# Altium schematic sheet shunts_and_amplifiers.SchDoc: Shunts and Amplifiers
size B; Engineer: Jacob Faucett; Organization: CUAir; Address1: L3, 12a Rodborough Rd; Address2: Frenchs Forest; Address3: NSW; Address4: Australia 2086; Revision: 1; SheetNumber: 6; SheetTotal: 9; CompetitionYear: 2025; CPN: N/A; PROJECT: Current Logging and Validation Board
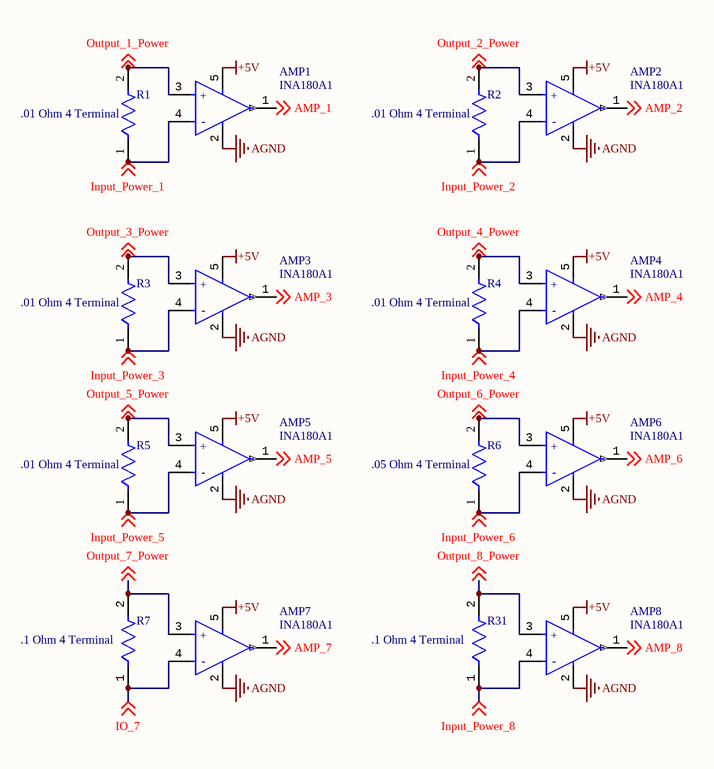
[diagram p0: shunts_and_amplifiers.SchDoc]

## Parts
AMP1  INA180A1  [FP-DBV0005A-IPC_A]
AMP2  INA180A1  [FP-DBV0005A-IPC_A]
AMP3  INA180A1  [FP-DBV0005A-IPC_A]
AMP4  INA180A1  [FP-DBV0005A-IPC_A]
AMP5  INA180A1  [FP-DBV0005A-IPC_A]
AMP6  INA180A1  [FP-DBV0005A-IPC_A]
AMP7  INA180A1  [FP-DBV0005A-IPC_A]
AMP8  INA180A1  [FP-DBV0005A-IPC_A]
R1  .01 Ohm 4 Terminal  [FP-WSR3-MFG]
R2  .01 Ohm 4 Terminal  [FP-WSR3-MFG]
R3  .01 Ohm 4 Terminal  [FP-WSR3-MFG]
R4  .01 Ohm 4 Terminal  [FP-WSR3-MFG]
R5  .01 Ohm 4 Terminal  [FP-WSR3-MFG]
R6  .05 Ohm 4 Terminal  [FP-WSR3-MFG]
R7  .1 Ohm 4 Terminal  [FP-WSR-MFG]
R31  .1 Ohm 4 Terminal  [FP-WSR-MFG]

## Nets
+5V: AMP1.5(VS) AMP2.5(VS) AMP3.5(VS) AMP4.5(VS) AMP5.5(VS) AMP6.5(VS) AMP7.5(VS) AMP8.5(VS)
AGND: AMP1.2(GND) AMP2.2(GND) AMP3.2(GND) AMP4.2(GND) AMP5.2(GND) AMP6.2(GND) AMP7.2(GND) AMP8.2(GND)
AMP_1: AMP1.1(OUT) ; off-sheet AMP_1
AMP_2: AMP2.1(OUT) ; off-sheet AMP_2
AMP_3: AMP3.1(OUT) ; off-sheet AMP_3
AMP_4: AMP4.1(OUT) ; off-sheet AMP_4
AMP_5: AMP5.1(OUT) ; off-sheet AMP_5
AMP_6: AMP6.1(OUT) ; off-sheet AMP_6
AMP_7: AMP7.1(OUT) ; off-sheet AMP_7
AMP_8: AMP8.1(OUT) ; off-sheet AMP_8
Input_Power_1: AMP1.4(IN-) R1.1 ; off-sheet Input_Power_1
Input_Power_2: AMP2.4(IN-) R2.1 ; off-sheet Input_Power_2
Input_Power_3: AMP3.4(IN-) R3.1 ; off-sheet Input_Power_3
Input_Power_4: AMP4.4(IN-) R4.1 ; off-sheet Input_Power_4
Input_Power_5: AMP5.4(IN-) R5.1 ; off-sheet Input_Power_5
Input_Power_6: AMP6.4(IN-) R6.1 ; off-sheet Input_Power_6
Input_Power_8: AMP8.4(IN-) R31.1 ; off-sheet Input_Power_8
IO_7: AMP7.4(IN-) R7.1 ; off-sheet IO_7
Output_1_Power: AMP1.3(IN+) R1.2 ; off-sheet Output_1_Power
Output_2_Power: AMP2.3(IN+) R2.2 ; off-sheet Output_2_Power
Output_3_Power: AMP3.3(IN+) R3.2 ; off-sheet Output_3_Power
Output_4_Power: AMP4.3(IN+) R4.2 ; off-sheet Output_4_Power
Output_5_Power: AMP5.3(IN+) R5.2 ; off-sheet Output_5_Power
Output_6_Power: AMP6.3(IN+) R6.2 ; off-sheet Output_6_Power
Output_7_Power: AMP7.3(IN+) R7.2 ; off-sheet Output_7_Power
Output_8_Power: AMP8.3(IN+) R31.2 ; off-sheet Output_8_Power

## Notes on the sheet
- Project
- Title
- Size:
- Date:
- B
- Number:
- Revision:
- File:
- (in symbol CMP-04895-000140-1) +; -

## Library data of the parts
AMP1-AMP8 = CMP-04895-000140-1: IC CURR SENSE 1 CIRCUIT SOT23-5; Input Bias Current: 100nA; Input Offset Voltage (Vos): 100uV; Number of Circuits: 1; Slew Rate: 2V/µs; -3db Bandwidth: 350kHz; Operating Supply Current: 260uA; Case/Package: SOT-23-5; Min Operating Temperature: -40°C; Mount: Surface Mount; Packaging: Tape and Reel; Max Operating Temperature: 125°C
R1-R6 = CMP-00030-39814339-1: WSR3R0500FEA Res Metal Strip 4527 0.05 Ohm 1% 3W ±75ppm/°C Molded SMD SMD Embossed Plastic T/R; Voltage Rating: 380mV; Resistance: 50mΩ; Mount: Surface Mount; Case/Package: 4527; Height: 2.41mm; Width: 6.98mm; Depth: 6.98mm; Lead Free: Lead Free; Schedule B: 8533210045, 8533210045; Max Operating Temperature: 275°C; Power Rating: 3W; Composition: Metal Strip; Contact Plating: Silver, Tin; Voltage Rating (DC): 380mV; Radiation Hardening: No; Termination: SMD/SMT; Tolerance: 1%; Length: 11.56mm; Min Operating Temperature: -65°C; Case Code (Imperial): 4527; REACH SVHC: No SVHC; Temperature Coefficient: 75ppm/°C; NexarPartId: 39814339; Packaging: Cut Tape; Military Standard: Not; RoHS: Compliant
R7 R31 = CMP-02407-000027-1: RES 0.1 OHM 1% 3W 4527 / WSR3R1000FEK; Manufacturer: Vishay; Value: 100mΩ; Temperature Coefficient: 75ppm/°C; Automotive Grade: Grade 0; Digikey Description: RES 0.1 OHM 1% 3W 4527; Temperature Range High: +275°C; ComponentLink2URL: http://www.vishay.com/docs/30101/wsr.pdf; Manufacturer Part Number: WSR3R1000FEK; RoHS: TRUE; Device Class L1: Passive Components; Automotive: Yes; Temperature Range Low: -65°C; Tolerance: 1%; Device Class L3: Chip SMD Resistors; Series: WSR; Temperature: -65°C to +275°C; Resistance: 100mΩ; Device Class L2: Resistors; Octopart: https://octopart.com/wsr3r1000fek-vishay-39709091; Package: WSR; Mouser Description: Res Metal Strip 4527 0.1 Ohm 1% 3W ±75ppm/C Sulfur Resistant Molded J-Lead SMD Automotive Bulk; Power Rating: 3W; ComponentLink2Description: Datasheet; Composition: Metal Strip; Category: Res; Lead Free: Yes; Height: 2.537mm